# Altium schematic sheet Connectors.SchDoc
size A4; SheetNumber: 3; SheetTotal: 7; SPICEModelCacheZWOSRZDM: <root> / <DocumentId>ZWOSRZDM</DocumentId> / </root>
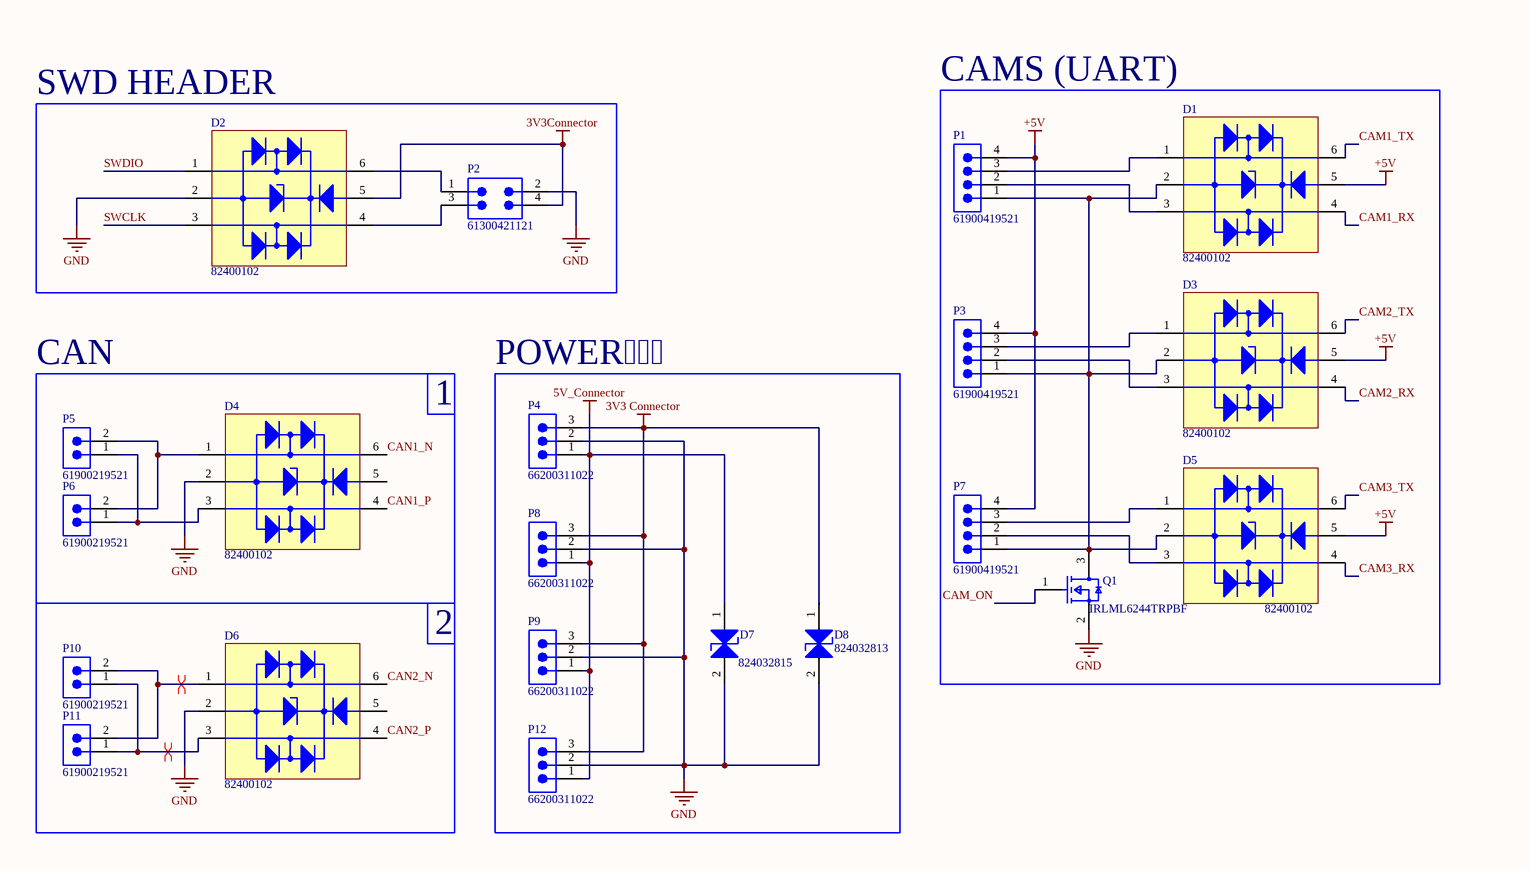
[diagram p0: Connectors.SchDoc, left]
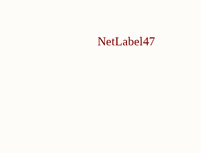
[diagram p1: Connectors.SchDoc, right]

## Parts
D1  82400102  [WE-TVS_SOT23-6L]
D2  82400102  [WE-TVS_SOT23-6L]
D3  82400102  [WE-TVS_SOT23-6L]
D4  82400102  [WE-TVS_SOT23-6L]
D5  82400102  [WE-TVS_SOT23-6L]
D6  82400102  [WE-TVS_SOT23-6L]
D7  824032815  [WE-TVS_DFN1610-2L]
D8  824032813  [WE-TVS_DFN1610-2L]
P1  61900419521  [61900419521]
P2  61300421121  [61300421121]
P3  61900419521  [61900419521]
P4  66200311022  [66200311022]
P5  61900219521  [61900219521]
P6  61900219521  [61900219521]
P7  61900419521  [61900419521]
P8  66200311022  [66200311022]
P9  66200311022  [66200311022]
P10  61900219521  [61900219521]
P11  61900219521  [61900219521]
P12  66200311022  [66200311022]
Q1  IRLML6244TRPBF  [FP-Micro3-IPC_C]

## Blocks framed on the sheet
CAMS (UART): D1 D3 D5 P1 P3 P7 Q1
SWD HEADER: D2 P2
POWER: D7 D8 P4 P8 P9 P12

## Nets
3V3 Connector: D8.1(I/O_1) P4.3 P8.3 P9.3 P12.3
3V3Connector: D2.5(VDD) P2.4
5V_Connector: D7.1(I/O_1) P4.1 P8.1 P9.1 P12.1
+5V: D1.5(VDD) D3.5(VDD) D5.5(VDD) P1.4 P3.4 P7.4
GND: D2.2(GND) D4.2(GND) D6.2(GND) D7.2(GND) D8.2(GND) P2.2 P4.2 P8.2 P9.2 P12.2 Q1.2(S)
CAM1_RX: D1.4(I/O_2)
CAM1_TX: D1.6(I/O_1)
CAM2_RX: D3.4(I/O_2)
CAM2_TX: D3.6(I/O_1)
CAM3_RX: D5.4(I/O_2)
CAM3_TX: D5.6(I/O_1)
CAM_ON: Q1.1(G)
CAN1_N: D4.6(I/O_1)
CAN1_P: D4.4(I/O_2)
CAN2_N: D6.6(I/O_1)
CAN2_P: D6.4(I/O_2)
SWCLK: D2.3(I/O_2)
SWDIO: D2.1(I/O_1)
NetD1_1: D1.1(I/O_1) P1.3
NetD1_2: D1.2(GND) D3.2(GND) D5.2(GND) P1.1 P3.1 P7.1 Q1.3(D)
NetD1_3: D1.3(I/O_2) P1.2
NetD2_4: D2.4(I/O_2) P2.3
NetD2_6: D2.6(I/O_1) P2.1
NetD3_1: D3.1(I/O_1) P3.3
NetD3_3: D3.3(I/O_2) P3.2
NetD4_1: D4.1(I/O_1) P5.2 P6.2
NetD4_3: D4.3(I/O_2) P5.1 P6.1
NetD5_1: D5.1(I/O_1) P7.3
NetD5_3: D5.3(I/O_2) P7.2
NetD6_1: D6.1(I/O_1) P10.2 P11.2
NetD6_3: D6.3(I/O_2) P10.1 P11.1

Not connected (* = marked no-connect by the designer): D4 5(VDD); D6 5(VDD)

## Layout directives
differential pair: NetD6_1, NetD6_3

## Notes on the sheet
- CAN
- 1
- 2
- Labels drawn without touching a wire or pin: NetLabel47

## Library data of the parts
D1-D6 = CMP-004-00017-1: WE-TVS TVS Diode – High Speed Series, SOT23-6L, 2+1 Channel, 5V, 2pF; Manufacturer: Wurth Elektronik; Polarity: Unidirectional; Channel ESD Clamping Voltage: 10V; ESD Air Discharge Capability: 15kV; (Reverse) Peak Pulse Current: 7A; (Reverse) Breakdown Voltage: 6V; Channel Reverse Leakage Current: 1uA; ESD Contact Discharge Capability: 8kV; Source: WE-TVS.SchLib; Component Type: Standard; Packaging: Tape and Reel; Height: 1.45mm; Pins: 6; Match Code: WE-TVS; Case/Package: SOT23-6L; Mount: Surface Mount; Channel Operating Voltage: 5V; ComponentLink1Description: Website Link; ComponentLink2URL: https://www.we-online.com/redexpert/spec/82400102?ad; Category: ESD Protection; Channel Input Capacitance: 2pF; Operating Temperature Min: -40°C; ComponentLink1URL: https://www.we-online.com/redexpert/article/82400102?ad; Length: 2.9mm; Width: 2.8mm; Manufacturer Part Number: 82400102; Design Item ID: 82400102; ComponentLink2Description: Datasheet Link; Operating Temperature Max: 125°C; Number of Channels: 2+1
D7 = CMP-03913-133963841-1: 824032815 Tvs Diode, Bidir, 5V, Dfn1610 Rohs Compliant: Yes; Min Operating Temperature: -55°C; Width: 1mm; NexarPartId: 133963841; Length: 1.6mm; RoHS: Compliant; Max Operating Temperature: 85°C; Height: 500µm
D8 = CMP-03913-133963840-1: 824032813 Tvs Diode, Bidir, 3.3V, Dfn1610 Rohs Compliant: Yes; Width: 1mm; NexarPartId: 133963840; Min Operating Temperature: -55°C; Max Operating Temperature: 125°C; Height: 500µm; Length: 1.6mm; RoHS: Compliant
P1 P3 P7 = CMP-002-00294-1: WR-WTB THT Male Right Angled Top Locking Header, pitch 2.54mm, 4pins; Manufacturer: Wurth Elektronik; Contact Resistance: 20mOhm; Withstanding Voltage: 1000VAC; Working Voltage: 250VAC; Rated Current: 3A; Operating Temperature Max: 105°C; Category: Wire-to-Board Connectors; Mount: Through Hole; Pin Count: 4; Design Item ID: 61900419521; ComponentLink2URL: https://www.we-online.com/redexpert/spec/61900419521?ad; Source: WR-WTB.SchLib; ComponentLink2Description: Datasheet Link; ComponentLink1URL: https://www.we-online.com/redexpert/article/61900419521?ad; Pins: 4; Number of Rows: 1; Height: 5.8mm; Component Type: Standard; Orientation: Right Angled Top Locking; Gender: Male; Packaging: Bag; ComponentLink1Description: Website Link; Manufacturer Part Number: 61900419521; Match Code: WR-WTB; Operating Temperature Min: -40°C; Width: 12.47mm; Pitch: 2.54mm; Length: 10.16mm
P2 = CMP-002-00747-2: Board Connector, 4 Contact(s), 2 Row(s), Male, Straight, 0.1 inch Pitch, Solder Terminal, Black Insulator, Plug; RoHS Compliant: Yes; Min Operating Temperature: -40°C; Mounting Technology: Board; Connector Type: BOARD CONNECTOR; Max Operating Temperature: 125°C
P4 P8 P9 P12 = CMP-002-00023-2: WR-MPC3 THT Male Right Angled Header with Plastic Pegs, pitch 3mm, 3p; Manufacturer: Wurth Elektronik; Contact Resistance: 10mOhm; Rated Current: 5A; Insulation Resistance: >1000MOhm; Working Voltage: 250V (AC); ComponentLink1URL: https://www.we-online.com/redexpert/article/66200311022?ad; Design Item ID: 66200311022; Number of Rows: 1; ComponentLink1Description: Website Link; ComponentLink2Description: Datasheet Link; Pins: 3; Gender: Male; Component Type: Standard; Operating Temperature Max: 105°C; Manufacturer Part Number: 66200311022; Category: Wire-to-Board Connectors; Source: WR-MPC3.SchLib; Pitch: 3mm; ComponentLink2URL: https://www.we-online.com/redexpert/spec/66200311022?ad; Mount: Through Hole; Operating Temperature Min: -40°C; Height: 5.57mm; Orientation: Right Angled; Length: 12.65mm; Width: 9.9mm; Pin Count: 3; Packaging: Tube; Match Code: WR-MPC3
P5 P6 P10 P11 = CMP-002-00288-1: WR-WTB THT Male Right Angled Top Locking Header, pitch 2.54mm, 2pins; Manufacturer: Wurth Elektronik; Working Voltage: 250VAC; Contact Resistance: 20mOhm; Rated Current: 3A; Withstanding Voltage: 1000VAC; Number of Rows: 1; Length: 5.08mm; ComponentLink1URL: https://www.we-online.com/redexpert/article/61900219521?ad; Mount: Through Hole; ComponentLink2Description: Datasheet Link; Pins: 2; Width: 12.47mm; Height: 5.8mm; Component Type: Standard; Orientation: Right Angled Top Locking; Match Code: WR-WTB; Design Item ID: 61900219521; Pitch: 2.54mm; ComponentLink2URL: https://www.we-online.com/redexpert/spec/61900219521?ad; Manufacturer Part Number: 61900219521; ComponentLink1Description: Website Link; Packaging: Bag; Gender: Male; Pin Count: 2; Operating Temperature Max: 105°C; Source: WR-WTB.SchLib; Category: Wire-to-Board Connectors; Operating Temperature Min: -40°C
Q1 = CMP-013-00010-1: Power Field-Effect Transistor, 6.3A I(D), 20V, 0.021ohm, 1-Element, N-Channel, Silicon, Metal-oxide Semiconductor FET, TO-236AB; RoHS Compliant: Yes; Max Operating Temperature: 150°C; Pins: 3